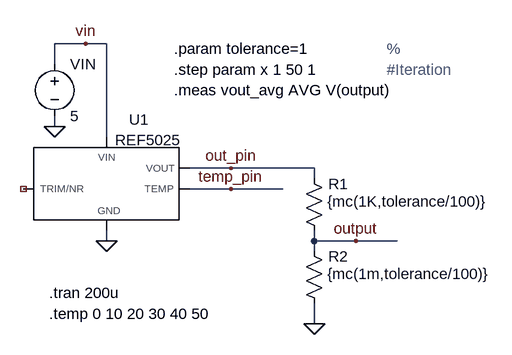
[diagram p0: schematic 02-REF5025_monte_carlo_voltage_divider.asc]
02-REF5025_monte_carlo_voltage_divider.asc, the LTspice schematic file:
Version 4
SHEET 1 880 680
WIRE 112 -48 64 -48
WIRE 144 -48 112 -48
WIRE 64 -16 64 -48
WIRE 64 80 64 64
WIRE 144 96 144 -48
WIRE 336 144 272 144
WIRE 464 144 336 144
WIRE 464 160 464 144
WIRE 336 176 272 176
WIRE 416 176 336 176
WIRE 144 256 144 240
WIRE 464 256 464 240
WIRE 528 256 464 256
WIRE 592 256 528 256
WIRE 464 272 464 256
WIRE 464 384 464 352
FLAG 144 256 0
FLAG 64 80 0
FLAG 336 144 out_pin
FLAG 336 176 temp_pin
FLAG 112 -48 vin
FLAG 464 384 0
FLAG 528 256 output
SYMBOL REF5025 160 176 R0
SYMATTR InstName U1
SYMBOL voltage 64 -32 R0
SYMATTR InstName VIN
SYMATTR Value 5
SYMBOL res 448 144 R0
WINDOW 0 38 24 Left 2
WINDOW 3 36 51 Left 2
SYMATTR InstName R1
SYMATTR Value {mc(1K,tolerance/100)}
SYMBOL res 448 256 R0
WINDOW 0 38 24 Left 2
WINDOW 3 36 51 Left 2
SYMATTR InstName R2
SYMATTR Value {mc(1m,tolerance/100)}
TEXT 56 336 Left 2 !.tran 200u
TEXT 56 368 Left 2 !.temp 0 10 20 30 40 50
TEXT 248 -40 Left 2 !.param tolerance=1
TEXT 576 -40 Left 2 ;%
TEXT 248 -8 Left 2 !.step param x 1 50 1
TEXT 248 24 Left 2 !.meas vout_avg AVG V(output)
TEXT 576 -8 Left 2 ;#Iteration

The netlist it stands for:
* 02-REF5025_monte_carlo_voltage_divider.asc
XU1 vin temp_pin 0 NC_01 out_pin REF5025  ; pins 2 3 4 5 6
VIN vin 0 5
R1 out_pin output {mc(1K,tolerance/100)}
R2 output 0 {mc(1m,tolerance/100)}
.tran 200u
.temp 0 10 20 30 40 50
.param tolerance=1
* %
.step param x 1 50 1
.meas vout_avg AVG V(output)
* #Iteration
.lib REF5025.LIB
.backanno
.end

* Results of the author's LTspice run, read from the files saved beside the schematic
* Operating Point (first step), zero values left out:
*   V(out_pin) = 2.501 V
*   V(vin) = 5 V
*   V(temp_pin) = 504.3 mV
*   V(output) = 2.53 µV
*   I(R1) = 2.526 mA
*   I(R2) = 2.526 mA
*   I(Vin) = -3.279 mA
*   Ix(u1:2) = 3.279 mA
*   Ix(u1:4) = -667.5 µA
*   Ix(u1:6) = -2.526 mA
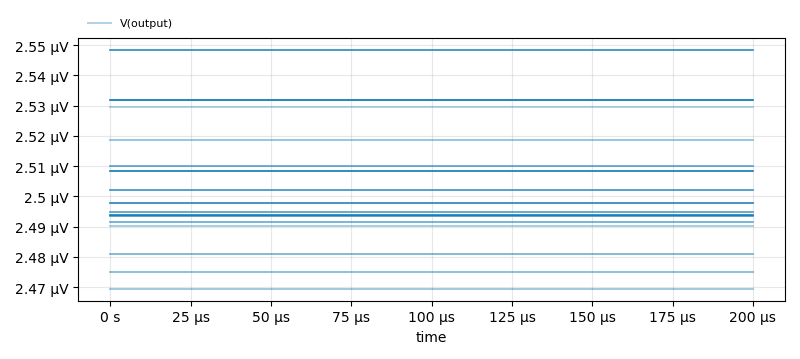
[diagram p1: Transient Analysis of 02-REF5025_monte_carlo_voltage_divider.asc, plotted from the saved traces]
* Transient Analysis, 300 runs:
*   V(output) [run 1]: min 2.53 µV, max 2.53 µV, average 2.53 µV, rms 2.53 µV, last 2.53 µV
*   V(output) [run 2]: min 2.49 µV, max 2.49 µV, average 2.49 µV, rms 2.49 µV, last 2.49 µV
*   V(output) [run 3]: min 2.469 µV, max 2.469 µV, average 2.469 µV, rms 2.469 µV, last 2.469 µV
*   V(output) [run 4]: min 2.519 µV, max 2.519 µV, average 2.519 µV, rms 2.519 µV, last 2.519 µV
*   V(output) [run 5]: min 2.475 µV, max 2.475 µV, average 2.475 µV, rms 2.475 µV, last 2.475 µV
*   V(output) [run 6]: min 2.481 µV, max 2.481 µV, average 2.481 µV, rms 2.481 µV, last 2.481 µV
*   V(output) [run 7]: min 2.492 µV, max 2.492 µV, average 2.492 µV, rms 2.492 µV, last 2.492 µV
*   V(output) [run 8]: min 2.51 µV, max 2.51 µV, average 2.51 µV, rms 2.51 µV, last 2.51 µV
* From the log:
*   Measurement: vout_avg
*     step  AVG(v(output))  FROM  TO
*        1  2.52951e-06  0  0.0002
*        2  2.53209e-06  0  0.0002
*        3  2.49587e-06  0  0.0002
*        4  2.5285e-06  0  0.0002
*        5  2.49733e-06  0  0.0002
*        6  2.53558e-06  0  0.0002
*        7  2.49128e-06  0  0.0002
*        8  2.4866e-06  0  0.0002
*        9  2.51489e-06  0  0.0002
*       10  2.50206e-06  0  0.0002
*       11  2.47423e-06  0  0.0002
*       12  2.49533e-06  0  0.0002
*       13  2.51973e-06  0  0.0002
*       14  2.50309e-06  0  0.0002
*       15  2.50139e-06  0  0.0002
*       16  2.52614e-06  0  0.0002
*       17  2.49617e-06  0  0.0002
*       18  2.52889e-06  0  0.0002
*       19  2.50205e-06  0  0.0002
*       20  2.49022e-06  0  0.0002
*       21  2.49371e-06  0  0.0002
*       22  2.49963e-06  0  0.0002
*       23  2.48127e-06  0  0.0002
*       24  2.48975e-06  0  0.0002
*       25  2.46868e-06  0  0.0002
*       26  2.5043e-06  0  0.0002
*       27  2.50127e-06  0  0.0002
*       28  2.49019e-06  0  0.0002
*       29  2.50268e-06  0  0.0002
*       30  2.46054e-06  0  0.0002
*       31  2.48689e-06  0  0.0002
*       32  2.47016e-06  0  0.0002
*       33  2.54709e-06  0  0.0002
*       34  2.50097e-06  0  0.0002
*       35  2.50627e-06  0  0.0002
*       36  2.49558e-06  0  0.0002
*       37  2.48711e-06  0  0.0002
*       38  2.48741e-06  0  0.0002
*       39  2.52571e-06  0  0.0002
*       40  2.46946e-06  0  0.0002
*     ...